# Altium schematic sheet Powers.SchDoc: Power, Charger, ON-OFF
size A4; Organization: Use Organization_Name in ProjParam; Address1: EFI & DBR; Address2: STI-IMT-LSRO1; Address3: EPFL; Address4: CH-1015 LAUSANNE; DocumentNumber: 12; Revision: A; SheetNumber: 11; SheetTotal: 2; ApprovedBy: Init ApprovedBy in DocParam; CheckedBy: Init CheckedBy in DocParam; Author: Init Author in DocParam; CompanyName: Init CompanyName in DocParam; DrawnBy: Init DrawBy in DocParam; Engineer: Init Engineer in DocParam; DocumentName: Init DocumentName in DocParam; ProjectName: Init ProjectName in DocParam
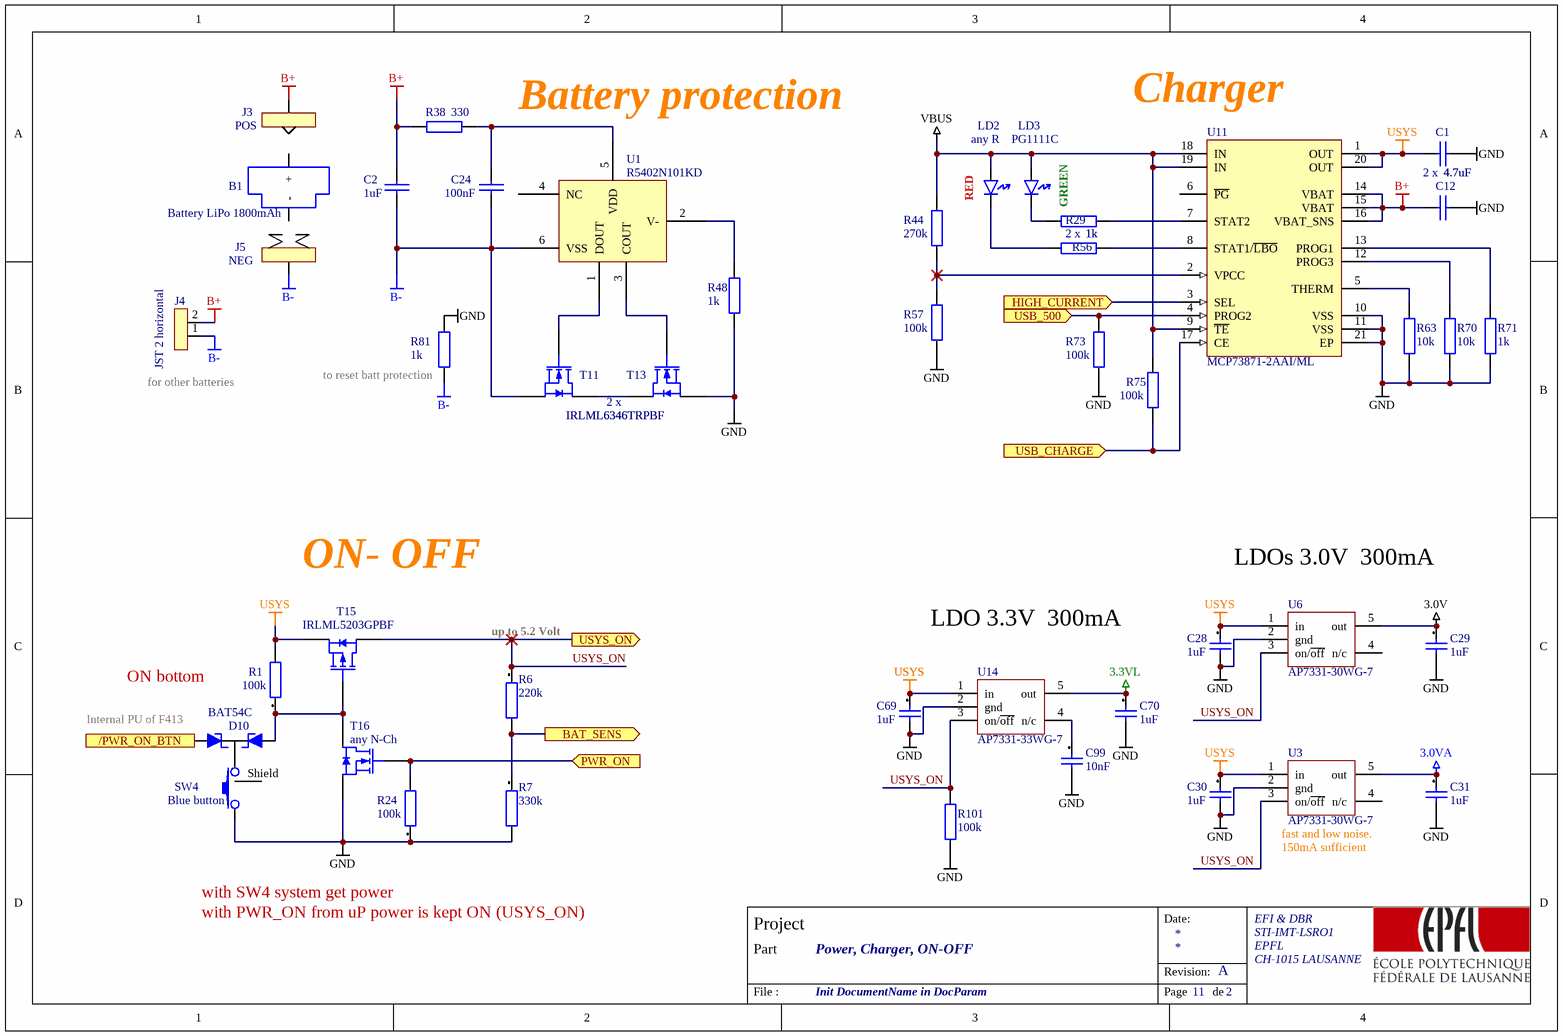
[diagram p0: Powers.SchDoc]

## Parts
B1  Battery LiPo 1800mAh  (graphical)
C1  4.7uF  [rob_0603]
C2  1uF  [rob_0603]
C12  4.7uF  [rob_0603]
C24  100nF  [rob_0603]
C28  1uF  [ROB_0603]
C29  1uF  [ROB_0603]
C30  1uF  [ROB_0603]
C31  1uF  [ROB_0603]
C69  1uF  [ROB_0603]
C70  1uF  [ROB_0603]
C99  10nF  [ROB_0603]
D10  BAT54C  [SOT23-3 - NEW]
J3  POS  [BATT_CON_EPUCK_P]
J4  JST 2 horizontal  [CON-JST-H]
J5  NEG  [BATT_CON_EPUCK_M]
LD2  value any R  [ROB_LED_0603]  (hidden comment: led red)
LD3  value PG1111C  [ROB_LED_0603]  (hidden comment: led green)
R1  100k  [ROB_0603]
R6  220k  [ROB_0603]
R7  330k  [ROB_0603]
R24  100k  [ROB_0603]
R29  1k  [rob_0603]
R38  330  [rob_0603]
R44  270k  [rob_0603]
R48  1k  [rob_0603]
R56  1k  [rob_0603]
R57  100k  [rob_0603]
R63  10k  [rob_0603]
R70  10k  [rob_0603]
R71  1k  [rob_0603]
R73  100k  [rob_0603]
R75  100k  [rob_0603]
R81  1k  [rob_0603]
R101  100k  [rob_0603]
SW4  Blue button  [SW7914J]
T11  IRLML6346TRPBF  [SOT23-3 - NEW]
T13  IRLML6346TRPBF  [SOT23-3 - NEW]
T15  IRLML5203GPBF  [SOT23-3 - NEW]
T16  any N-Ch  [SOT23-3 - NEW]
U1  R5402N101KD  [SOT23-6]
U3  value AP7331-30WG-7  [Sot23-5]  (hidden comment: LDO 3V low noise)
U6  value AP7331-30WG-7  [Sot23-5]  (hidden comment: LDO 3V low noise)
U11  MCP73871-2AAI/ML  [SQFN20 4x4mm]
U14  value AP7331-33WG-7  [Sot23-5]  (hidden comment: LDO 3V3)

## Ports
/PWR_ON_BTN (out), BAT_SENS (out), HIGH_CURRENT (in), PWR_ON (in), USB_500 (in), USB_CHARGE (in), USYS_ON (out)

## Nets
3.0V: C29.1 U6.5(out)
3.0VA: C31.1 U3.5(out)
3.3VL: C70.1 U14.5(out)
B+: C2.2 C12.1 J3.1(batt) J4.2 R38.2 U11.14(VBAT) U11.15(VBAT) U11.16(VBAT_SNS)
B-: C2.1 C24.1 J4.1 J5.1(batt) R81.1 T11.2(S) U1.6(VSS)
GND: C1.1 C12.2 C28.2 C29.2 C30.2 C31.2 C69.2 C70.2 C99.2 R7.2 R24.1 R48.1 R57.1 R63.1 R70.1 R71.1 R73.1 R81.2 R101.1 SW4.1 T13.2(S) T16.2(S) U3.2(gnd) U6.2(gnd) U11.10(VSS) U11.11(VSS) U11.21(EP) U14.2(gnd)
USYS: C1.2 C28.1 C30.1 C69.1 R1.2 T15.2(S) U3.1(in) U6.1(in) U11.1(OUT) U11.20(OUT) U14.1(in)
VBUS: LD2.2(A) LD3.2(A) R44.1 R75.1 U11.9(~{TE}) U11.18(IN) U11.19(IN)
/PWR_ON_BTN: D10.2(A) ; port /PWR_ON_BTN
BAT_SENS: R6.2 R7.1 ; port BAT_SENS
HIGH_CURRENT: U11.3(SEL) ; port HIGH_CURRENT
PWR_ON: R24.2 T16.1(G) ; port PWR_ON
USB_500: R73.2 U11.4(PROG2) ; port USB_500
USB_CHARGE: R75.2 U11.17(CE) ; port USB_CHARGE
USYS_ON: R6.1 R101.2 T15.3(D) U3.3(on/~{off}) U6.3(on/~{off}) U14.3(on/~{off}) ; port USYS_ON
NetC24_2: C24.2 R38.1 U1.5(VDD)
NetC99_1: C99.1 U14.4(n/c)
NetD10_1: D10.1(A) R1.1 T15.1(G) T16.3(D)
NetD10_3: D10.3(§) SW4.2
NetLD2_1: LD2.1(K) R56.2
NetLD3_1: LD3.1(K) R29.2
NetR29_1: R29.1 U11.7(STAT2)
NetR44_2: R44.2 R57.2 U11.2(VPCC)
NetR48_2: R48.2 U1.2(V-)
NetR56_1: R56.1 U11.8(STAT1/~{LBO})
NetR63_2: R63.2 U11.5(THERM)
NetR70_2: R70.2 U11.12(PROG3)
NetR71_2: R71.2 U11.13(PROG1)
NetT11_1: T11.1(G) U1.1(DOUT)
NetT11_3: T11.3(D) T13.3(D)
NetT13_1: T13.1(G) U1.3(COUT)

Not connected (* = marked no-connect by the designer): B1 1(-) 2(+); SW4 Shield; U1 4(NC); U3 4(n/c); U6 4(n/c); U11 6(~{PG})

## Notes on the sheet
- Battery protection
- (near U11) Charger
- (near C1) 2 x
- (near LD2) RED
- 2 x
- (near R29) GREEN
- (near J4) for other batteries
- (near R81) to reset batt protection
- ON- OFF
- LDOs 3.0V  300mA
- up to 5.2 Volt
- LDO 3.3V  300mA
- ON bottom
- (near D10) Internal PU of F413
- (near U3) 150mA sufficient
- (near U3) fast and low noise.
- with SW4 system get power
- with PWR_ON from uP power is kept ON (USYS_ON)
- Date:
- Project
- Part
- Revision:
- File :
- Page
- de

## Library data of the parts
B1 = BATT
C1 C2 C12 C24 = CAPA_ACORT: Capacitor; ClassName: Charger
  C1 C12: Value: 4.7uF
  C2: Value: 1uF
  C24: Value: 100nF
C28-C30 C69 C70 C99 = 1uF[[/\]]0603[[/\]]2: Capacitor; Manufacturer: Kemet; Manufacturer Nr: C0603C105K3PAC; Preference: 2; Tolerance +: +10; Tolerance -: -10; Dielectric: X7R; Voltage: 25; MaxTemperature: +125; MinTemperature: -55; Quant_1: 10; Quant_2: 100; Quant_3: 1000; Quant_4: 4000; Currentie: CHF; Size: 0603; Footprint Acort: 0603_G; Supplier: Farnell; Supplier Nr: 1288202; ComponentLink2Description: Farnell link; ComponentLink2URL: http://ch.farnell.com/jsp/displayProduct.jsp?sku=1288202; Price_1: 0,235; Price_2: 0,151; Price_3: 0,12; Price_4: 0,088; ROHS: True; DateLastUpdate: 2007-12-03 / 14:22:47
  C28-C30 C69 C70: Value: 1uF
  C99: Value: 10nF
C31 = 1uF[[/\]]0603[[/\]]1: Capacitor; Manufacturer: Murata; Manufacturer Nr: GRM188R61E105K; Preference: 1; Tolerance +: +10; Tolerance -: -10; Dielectric: X5R; Voltage: 25; MaxTemperature: +85; MinTemperature: -55; Quant_1: 10; Quant_2: 100; Quant_3: 500; Currentie: CHF; Size: 0603; Footprint Acort: 0603_G; Supplier: Distrelec; Supplier Nr: 823495; ComponentLink2Description: Distrelec link; ComponentLink2URL: http://www.distrelec.com/ishopWebFront/search/luceneSearch.do?dispatch=find&showImage=on&artnrPhrase=823495; Price_1: 0,1797; Price_2: 0,1474; Price_3: 0,1162; ROHS: True; DateLastUpdate: 2007-12-03 / 14:22:46; Value: 1uF
D10 = Diode double com. K: Small signal double diode; Manufacturer: Generic Components; Class I: Discrete; Class II: Diode - Switching; Published: 8-Jun-2000; Revision: July-2002: Re-released for DXP Platform.; Publisher: Altium Limited; Value: BAT54C
J3 = BATT_CON_EPUCK_P
J4 = CON-SIL-2: batt contact  S2B-PH-K-S; value: farnell 9491902
J5 = BATT_CON_EPUCK_M
LD2 = LED SMD: LED charging
LD3 = LED SMD: LED charged
R1 R6 R7 R24 = 100K[[/\]]0603[[/\]]2: Resistor; Manufacturer: Multicomp; Manufacturer Nr: MC 0.063W 0603 1% 100K; Tolerance: +/-1; Preference: 2; Power: 0.063; Voltage: 50; Current: 1; ppm/K: +/-100; Quant_2: 250; Quant_3: 1000; Quant_4: 5000; Quant_5: 15000; Currentie: CHF; Size: 0603; Footprint Acort: 0603; ComponentLink1Description: OnLine datasheet; Supplier: Farnell; Supplier Nr: 9330402; ComponentLink2Description: Farnell link; ComponentLink2URL: http://ch.farnell.com/jsp/displayProduct.jsp?sku=9330402; ROHS: True; Quant_1: 50; Price_1: 0,062; Price_2: 0,049; Price_3: 0,038; Price_4: 0,027; Price_5: 0,021; DateLastUpdate: 2007-11-29 / 09:15:00
  R1 R24: Value: 100k
  R6: Value: 220k
  R7: Value: 330k
R29 R38 R44 R48 R56 R57 R63 R70 R71 R73 R75 R81 R101 = RES_ACORT: Resistor
  R29 R48 R56 R71 R81: Value: 1k
  R38: Value: 330
  R44: Value: 270k
  R57 R73 R75 R101: Value: 100k
  R63 R70: Value: 10k
SW4 = MM6FVS[[/\]]1: push button 7914J; Manufacturer: Tyco; Manufacturer Nr: 7-188275-6; Preference: 1; Currentie: CHF; Quant_1: 10; Quant_2: 900; Circuit: SPST-NO; Switch Function: Off-Mom; Contact Rating @ Voltage: 0.05A @ 32VDC; Actuator Type: Standard; Actuator Height off PCB, from Pins: 1.90mm; Actuator Orientation: Top Actuated; Outline: 4.60mm x 2.80mm; Illumination: Non-Illuminated; Operating Force: 200gf; Switch Travel: 0.25mm; Mechanical Life: 200,000 Cycles; Footprint Acort: ToDefine; ComponentLink1Description: Datasheet; ComponentLink1URL: http://ecommas.tycoelectronics.com/commerce/DocumentDelivery/DDEController?Action=showdoc&DocId=Customer+Drawing%7F188275%7FR%7Fpdf%7FEnglish%7FC_188275_R.pdf; Supplier: Farnell; Supplier Nr: 1056234; ComponentLink2Description: Farnell link; ComponentLink2URL: http://fr.farnell.com/jsp/displayProduct.jsp?sku=1056234; ROHS: True; Type: SMD; Orientation: Vertical; DateLastUpdate: 2007-12-04 / 09:15:57; Price_1: 1,1; Price_2: 0,924; Supplier 1: Digi-Key; Value: 7914J; Category: Switches; Stock 1: 20549; Pricing 1: 1=0.51, 10=0.493, 25=0.484, 50=0.4656, 100=0.4017, 250=0.3652, 500=0.34694, 1000=0.2739 (USD); Packaging: Cut Tape (CT); Mounting Type: Surface Mount; Termination Style: Gull Wing; Illumination Voltage (Nominal): -; Illumination Type, Color: -; Ingress Protection: -; Features: Grounding Pin; Actuator Material: -; Operating Temperature: -40°C ~ 85°C; ComponentLink3URL: http://www.ck-components.com/index.php?module=media&action=Display&cmpref=14414&lang=en&width=&height=&format=&alt=; ComponentLink3Description: http://www.ck-components.com/index.php?module=media&action=Display&cmpref=14414&lang=en&width=&height=&format=&alt=; Supplier Part Number 1: 401-1427-1-ND
T11 T13 T16 = IRLML6346TRPBF: N-Channel MOSFET Rds 0.063ohm@3.4A; PackageDocument: 1995/1996; Published: 8-Jun-2000; LatestRevisionDate: 17-Jul-2002; LatestRevisionNote: Re-released for DXP Platform.; PackageReference: E3; Publisher: Altium Limited
  T11 T13: Value: IRLML6346TRPBF
  T16: Value: any N-Ch
T15 = IRLML5203GPBF: P-Channel MOSFET Rds 0.165ohm@2.6A; PackageDocument: 1995/1996; Published: 8-Jun-2000; LatestRevisionDate: 17-Jul-2002; LatestRevisionNote: Re-released for DXP Platform.; PackageReference: E3; Publisher: Altium Limited; Value: IRLML5203GPBF
U1 = R5402N128EC: Li-ion/polymer 1Cell Protector; Value: R5402N101KD
U3 U6 U14 = LP2981
U11 = MCP73871: Stand-Alone System Load Sharing and Li-Ion / Li-Polymer  Battery Charge Management Controller; Published: 29-Jan-2009; DatasheetVersion: revC, Apr-2008; PackageVersion: revAW, Oct-2008; PackageReference: TQFP-PT100; Publisher: Altium Limited; PackageDescription: 100-Lead Plastic Thin Quad Flatpack (PT) - 12x12x1mm Body, 2.00mm [TQFP]; ComponentLink1Description: Manufacturer Link; ComponentLink1URL: http://www.microchip.com; ComponentLink2Description: Datasheet; ComponentLink2URL: http://ww1.microchip.com/downloads/en/DeviceDoc/PIC32MX_Datasheet_v3_61143C.pdf; ComponentLink3Description: Packaging Specification; ComponentLink3URL: http://ww1.microchip.com/downloads/en/PackagingSpec/00049AW.pdf; Value: MCP73871-2AAI/ML